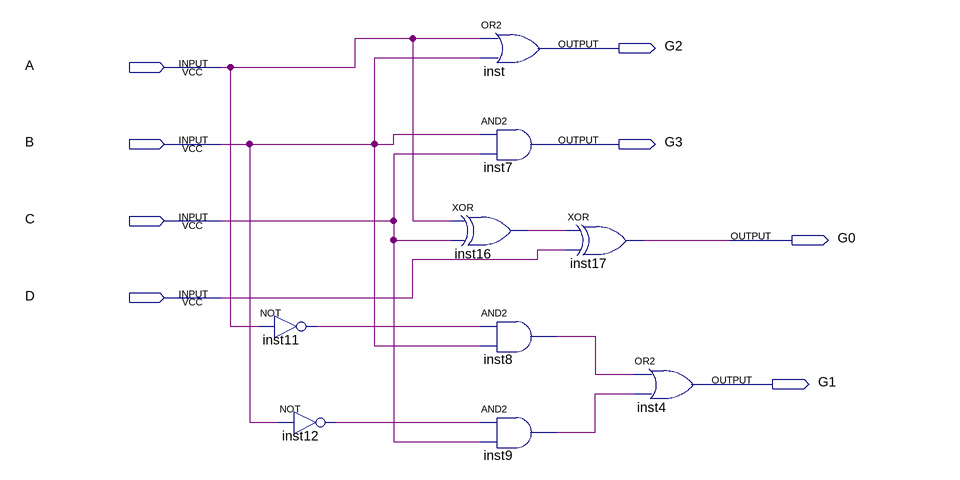
[diagram p0: schematic sheet]
// Quartus schematic lab3.bdf as structural Verilog: 9 symbols, 8 pins
module lab3 (
  input  A,
  input  B,
  input  C,
  input  D,
  output G2,
  output G3,
  output G0,
  output G1
);

  wire inst8_out, inst9_out, inst11_out, inst12_out, inst16_out;

  not inst11 (inst11_out, A);
  not inst12 (inst12_out, B);
  xor inst16 (inst16_out, A, C);
  or inst (G2, A, B);
  and inst7 (G3, B, C);
  and inst8 (inst8_out, inst11_out, B);
  and inst9 (inst9_out, inst12_out, C);
  xor inst17 (G0, inst16_out, D);
  or inst4 (G1, inst8_out, inst9_out);
endmodule
